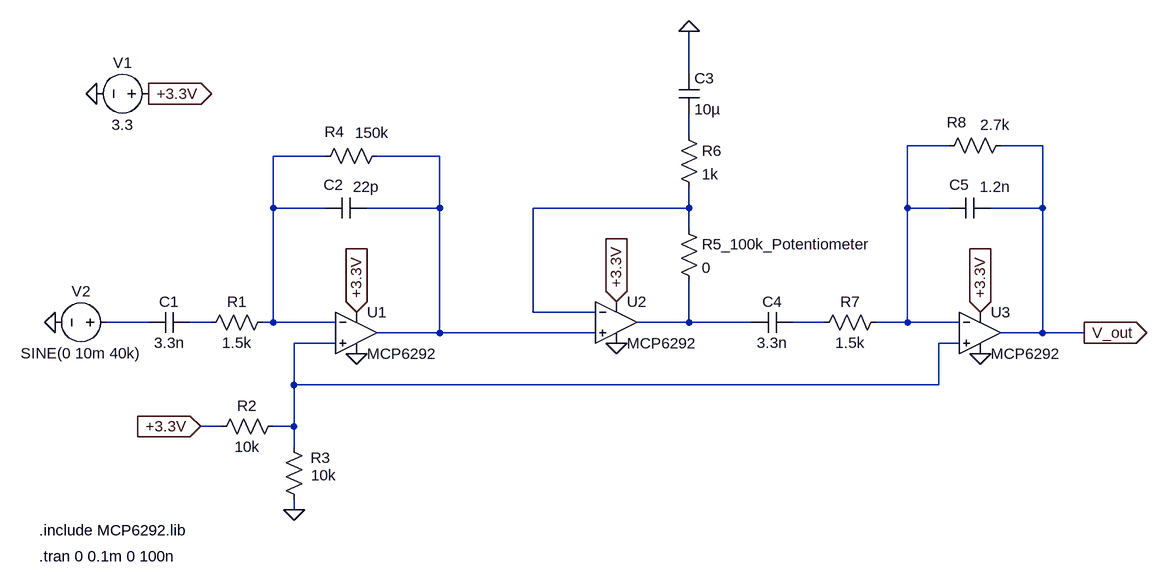
[diagram p0: schematic receiver_circuit.asc]
receiver_circuit.asc, the LTspice schematic file:
Version 4.1
SHEET 1 1584 680
WIRE 832 -224 832 -288
WIRE 832 -128 832 -160
WIRE 1232 -112 1168 -112
WIRE 1376 -112 1312 -112
WIRE 272 -96 192 -96
WIRE 448 -96 352 -96
WIRE 192 -16 192 -96
WIRE 272 -16 192 -16
WIRE 448 -16 448 -96
WIRE 448 -16 336 -16
WIRE 832 -16 832 -48
WIRE 832 -16 592 -16
WIRE 1168 -16 1168 -112
WIRE 1232 -16 1168 -16
WIRE 1376 -16 1376 -112
WIRE 1376 -16 1296 -16
WIRE 832 16 832 -16
WIRE 592 144 592 -16
WIRE 688 144 592 144
WIRE 0 160 -64 160
WIRE 96 160 64 160
WIRE 192 160 192 -16
WIRE 192 160 176 160
WIRE 288 160 192 160
WIRE 832 160 832 96
WIRE 832 160 752 160
WIRE 928 160 832 160
WIRE 1040 160 992 160
WIRE 1168 160 1168 -16
WIRE 1168 160 1120 160
WIRE 1248 160 1168 160
WIRE 448 176 448 -16
WIRE 448 176 352 176
WIRE 688 176 448 176
WIRE 1376 176 1376 -16
WIRE 1376 176 1312 176
WIRE 1440 176 1376 176
WIRE 288 192 224 192
WIRE 1248 192 1216 192
WIRE 224 256 224 192
WIRE 1216 256 1216 192
WIRE 1216 256 224 256
WIRE 112 320 80 320
WIRE 224 320 224 256
WIRE 224 320 192 320
WIRE 224 352 224 320
WIRE 224 448 224 432
FLAG -80 -192 0
FLAG 0 -192 +3.3V
IOPIN 0 -192 Out
FLAG 80 320 +3.3V
IOPIN 80 320 In
FLAG 224 448 0
FLAG 320 208 0
FLAG 320 144 +3.3V
IOPIN 320 144 In
FLAG 1440 176 V_out
IOPIN 1440 176 Out
FLAG -144 160 0
FLAG 720 192 0
FLAG 720 128 +3.3V
IOPIN 720 128 In
FLAG 832 -288 0
FLAG 1280 208 0
FLAG 1280 144 +3.3V
IOPIN 1280 144 In
SYMBOL cap 64 144 R90
WINDOW 0 0 32 VBottom 2
WINDOW 3 32 32 VTop 2
SYMATTR InstName C1
SYMATTR Value 3.3n
SYMBOL res 192 144 R90
WINDOW 0 0 56 VBottom 2
WINDOW 3 32 56 VTop 2
SYMATTR InstName R1
SYMATTR Value 1.5k
SYMBOL OpAmps\\opamp2 320 112 R0
SYMATTR InstName U1
SYMATTR Value MCP6292
SYMBOL voltage 16 -192 R90
WINDOW 0 -32 56 VBottom 2
WINDOW 3 32 56 VTop 2
WINDOW 123 0 0 Left 0
WINDOW 39 0 0 Left 0
SYMATTR InstName V1
SYMATTR Value 3.3
SYMBOL res 208 304 R90
WINDOW 0 0 56 VBottom 2
WINDOW 3 32 56 VTop 2
SYMATTR InstName R2
SYMATTR Value 10k
SYMBOL res 240 448 R180
WINDOW 0 -40 80 Left 2
WINDOW 3 -49 53 Left 2
SYMATTR InstName R3
SYMATTR Value 10k
SYMBOL cap 336 -32 R90
WINDOW 0 -4 51 VBottom 2
WINDOW 3 -32 1 VTop 2
SYMATTR InstName C2
SYMATTR Value 22p
SYMBOL res 368 -112 R90
WINDOW 0 -6 82 VBottom 2
WINDOW 3 -35 24 VTop 2
SYMATTR InstName R4
SYMATTR Value 150k
SYMBOL voltage -48 160 R90
WINDOW 0 -32 56 VBottom 2
WINDOW 3 32 56 VTop 2
WINDOW 123 0 0 Left 0
WINDOW 39 0 0 Left 0
SYMATTR InstName V2
SYMATTR Value SINE(0 10m 40k)
SYMBOL OpAmps\\opamp2 720 96 R0
SYMATTR InstName U2
SYMATTR Value MCP6292
SYMBOL res 816 0 R0
SYMATTR InstName R5_100k_Potentiometer
SYMATTR Value 0
SYMBOL res 816 -144 R0
SYMATTR InstName R6
SYMATTR Value 1k
SYMBOL cap 816 -224 R0
SYMATTR InstName C3
SYMATTR Value 10µ
SYMBOL OpAmps\\opamp2 1280 112 R0
SYMATTR InstName U3
SYMATTR Value MCP6292
SYMBOL res 1136 144 R90
WINDOW 0 0 56 VBottom 2
WINDOW 3 32 56 VTop 2
SYMATTR InstName R7
SYMATTR Value 1.5k
SYMBOL res 1328 -128 R90
WINDOW 0 -4 84 VBottom 2
WINDOW 3 -32 25 VTop 2
SYMATTR InstName R8
SYMATTR Value 2.7k
SYMBOL cap 992 144 R90
WINDOW 0 0 32 VBottom 2
WINDOW 3 32 32 VTop 2
SYMATTR InstName C4
SYMATTR Value 3.3n
SYMBOL cap 1296 -32 R90
WINDOW 0 -4 48 VBottom 2
WINDOW 3 -32 -7 VTop 2
SYMATTR InstName C5
SYMATTR Value 1.2n
TEXT -168 480 Left 2 !.include MCP6292.lib
TEXT -168 520 Left 2 !.tran 0 0.1m 0 100n

The netlist it stands for:
* receiver_circuit.asc
C1 N007 N006 3.3n
R1 N003 N007 1.5k
X§U1 N010 N003 +3.3V 0 N004 MCP6292  ; pins In+ In- V+ V- OUT
V1 +3.3V 0 3.3
R2 N010 +3.3V 10k
R3 0 N010 10k
C2 N004 N003 22p
R4 N004 N003 150k
V2 N006 0 SINE(0 10m 40k)
X§U2 N004 N005 +3.3V 0 N008 MCP6292  ; pins In+ In- V+ V- OUT
R5_100k_Potentiometer N005 N008 0
R6 N001 N005 1k
C3 0 N001 10µ
X§U3 N010 N002 +3.3V 0 V_out MCP6292  ; pins In+ In- V+ V- OUT
R7 N002 N009 1.5k
R8 V_out N002 2.7k
C4 N009 N008 3.3n
C5 V_out N002 1.2n
.include MCP6292.lib
.tran 0 0.1m 0 100n
.backanno
.end